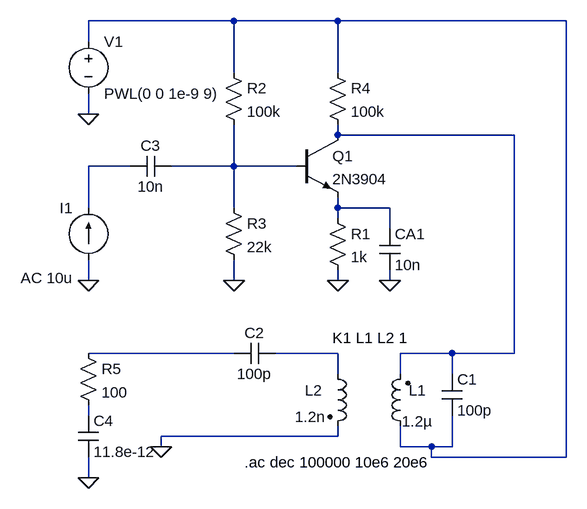
[diagram p0: schematic Barkhausen_ejemplo1_circuito_Labierto.asc]
Barkhausen_ejemplo1_circuito_Labierto.asc, the LTspice schematic file:
Version 4
SHEET 1 880 680
WIRE 32 -272 -192 -272
WIRE 192 -272 32 -272
WIRE 544 -272 192 -272
WIRE -192 -240 -192 -272
WIRE 32 -192 32 -272
WIRE 192 -192 192 -272
WIRE -192 -128 -192 -160
WIRE 192 -96 192 -112
WIRE 464 -96 192 -96
WIRE -128 -48 -192 -48
WIRE 32 -48 32 -112
WIRE 32 -48 -64 -48
WIRE 128 -48 32 -48
WIRE -192 16 -192 -48
WIRE 32 16 32 -48
WIRE 192 16 192 0
WIRE 272 16 192 16
WIRE 192 32 192 16
WIRE 272 48 272 16
WIRE -192 128 -192 96
WIRE 32 128 32 96
WIRE 192 128 192 112
WIRE 272 128 272 112
WIRE 32 240 -192 240
WIRE 192 240 96 240
WIRE 368 240 288 240
WIRE 464 240 464 -96
WIRE 464 240 368 240
WIRE 192 272 192 240
WIRE 288 272 288 240
WIRE 368 272 368 240
WIRE -192 336 -192 320
WIRE 192 368 192 352
WIRE 192 368 -80 368
WIRE -80 384 -80 368
WIRE 288 384 288 352
WIRE 336 384 288 384
WIRE 368 384 368 336
WIRE 368 384 336 384
WIRE 336 400 336 384
WIRE 544 400 544 -272
WIRE 544 400 336 400
WIRE -192 432 -192 400
FLAG 192 128 0
FLAG 272 128 0
FLAG 32 128 0
FLAG -80 384 0
FLAG -192 -128 0
FLAG -192 128 0
FLAG -192 432 0
SYMBOL npn 128 -96 R0
SYMATTR InstName Q1
SYMATTR Value 2N3904
SYMBOL res 176 16 R0
SYMATTR InstName R1
SYMATTR Value 1k
SYMBOL cap 256 48 R0
SYMATTR InstName CA1
SYMATTR Value 10n
SYMBOL res 16 -208 R0
SYMATTR InstName R2
SYMATTR Value 100k
SYMBOL res 16 0 R0
SYMATTR InstName R3
SYMATTR Value 22k
SYMBOL cap 352 272 R0
SYMATTR InstName C1
SYMATTR Value 100p
SYMBOL ind2 304 368 R180
WINDOW 0 -24 71 Left 2
WINDOW 3 -34 23 Left 2
SYMATTR InstName L1
SYMATTR Value 1.2µ
SYMATTR Type ind
SYMBOL ind2 176 256 R0
WINDOW 0 -35 41 Left 2
WINDOW 3 -50 82 Left 2
SYMATTR InstName L2
SYMATTR Value 1.2n
SYMATTR Type ind
SYMBOL cap 96 224 R90
WINDOW 0 0 32 VBottom 2
WINDOW 3 32 32 VTop 2
SYMATTR InstName C2
SYMATTR Value 100p
SYMBOL res 176 -208 R0
SYMATTR InstName R4
SYMATTR Value 100k
SYMBOL voltage -192 -256 R0
WINDOW 123 0 0 Left 0
WINDOW 39 0 0 Left 0
SYMATTR InstName V1
SYMATTR Value PWL(0 0 1e-9 9)
SYMBOL current -192 96 R180
WINDOW 0 24 80 Left 2
WINDOW 3 24 0 Left 2
WINDOW 123 24 -28 Left 2
WINDOW 39 0 0 Left 0
SYMATTR InstName I1
SYMATTR Value ""
SYMATTR Value2 AC 10u
SYMBOL cap -128 -32 R270
WINDOW 0 32 32 VTop 2
WINDOW 3 0 32 VBottom 2
SYMATTR InstName C3
SYMATTR Value 10n
SYMBOL res -208 224 R0
SYMATTR InstName R5
SYMATTR Value 100
SYMBOL cap -208 336 R0
SYMATTR InstName C4
SYMATTR Value 11.8e-12
TEXT 184 216 Left 2 !K1 L1 L2 1
TEXT 48 408 Left 2 !.ac dec 100000 10e6 20e6

The netlist it stands for:
* Barkhausen_ejemplo1_circuito_Labierto.asc
Q1 N002 N004 N005 0 2N3904
R1 N005 0 1k
CA1 N005 0 10n
R2 N001 N004 100k
R3 N004 0 22k
C1 N002 N001 100p
L1 N001 N002 1.2µ
L2 N007 0 1.2n
C2 N007 N006 100p
R4 N001 N002 100k
V1 N001 0 PWL(0 0 1e-9 9)
I1 0 N003 AC 10u
C3 N003 N004 10n
R5 N006 N008 100
C4 N008 0 11.8e-12
.model NPN NPN
.model PNP PNP
.lib standard.bjt
K1 L1 L2 1
.ac dec 100000 10e6 20e6
.backanno
.end